# EAGLE design BusPirate-v5 (EAGLE 7.6.0)
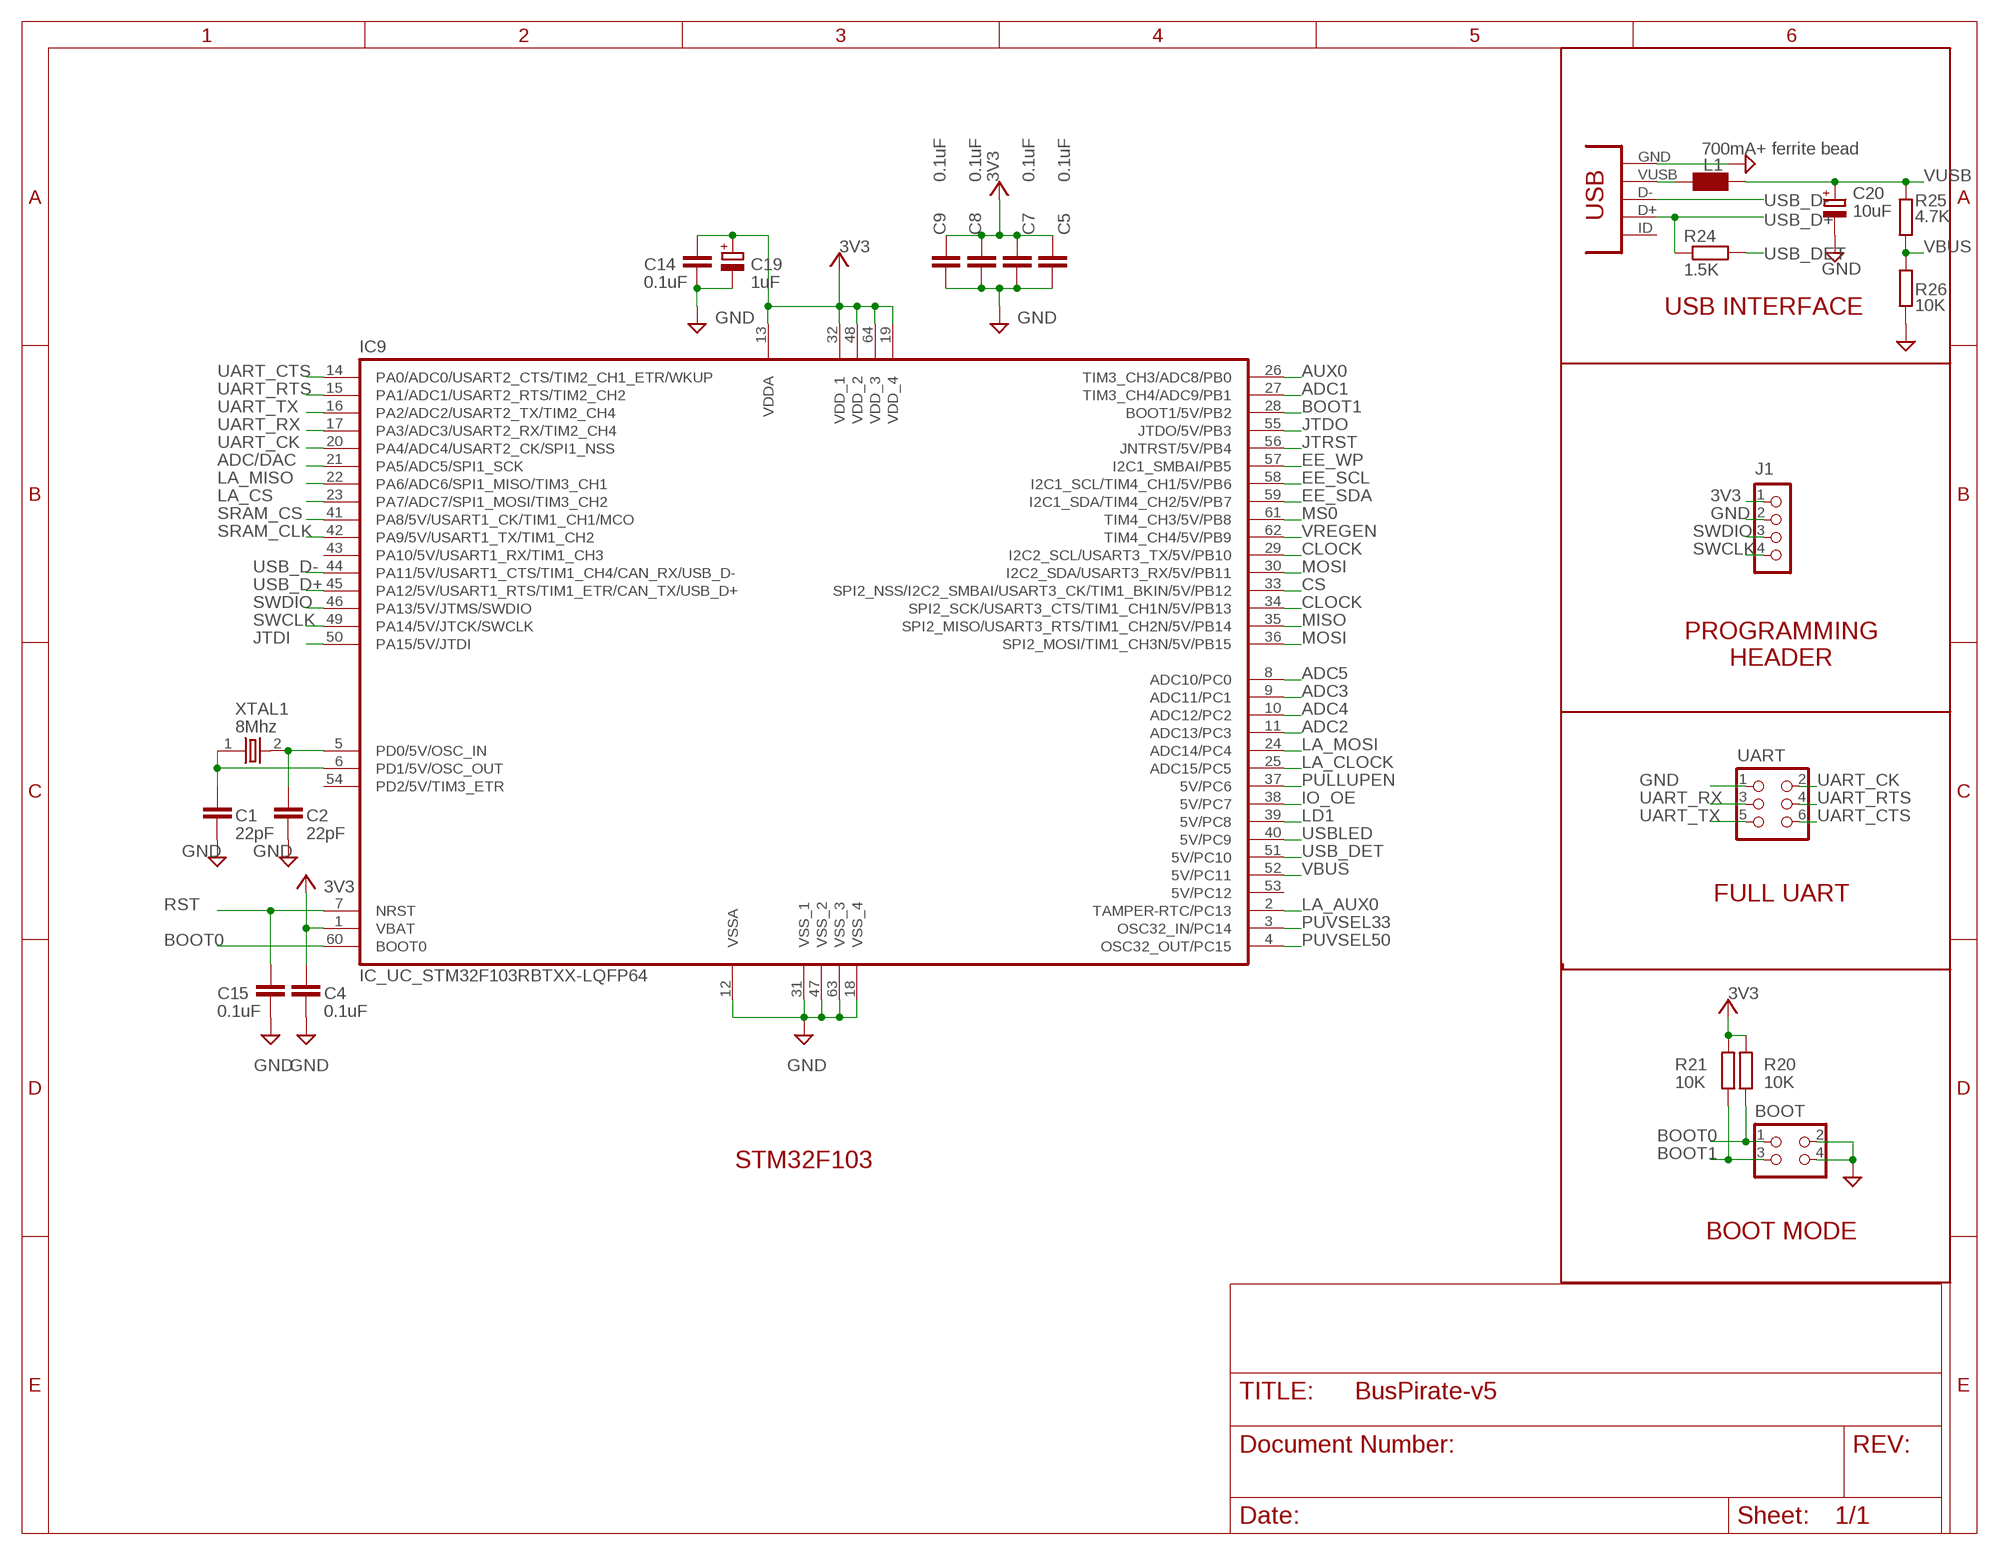
[diagram p0: schematic, sheet 1, part 1 of 2]
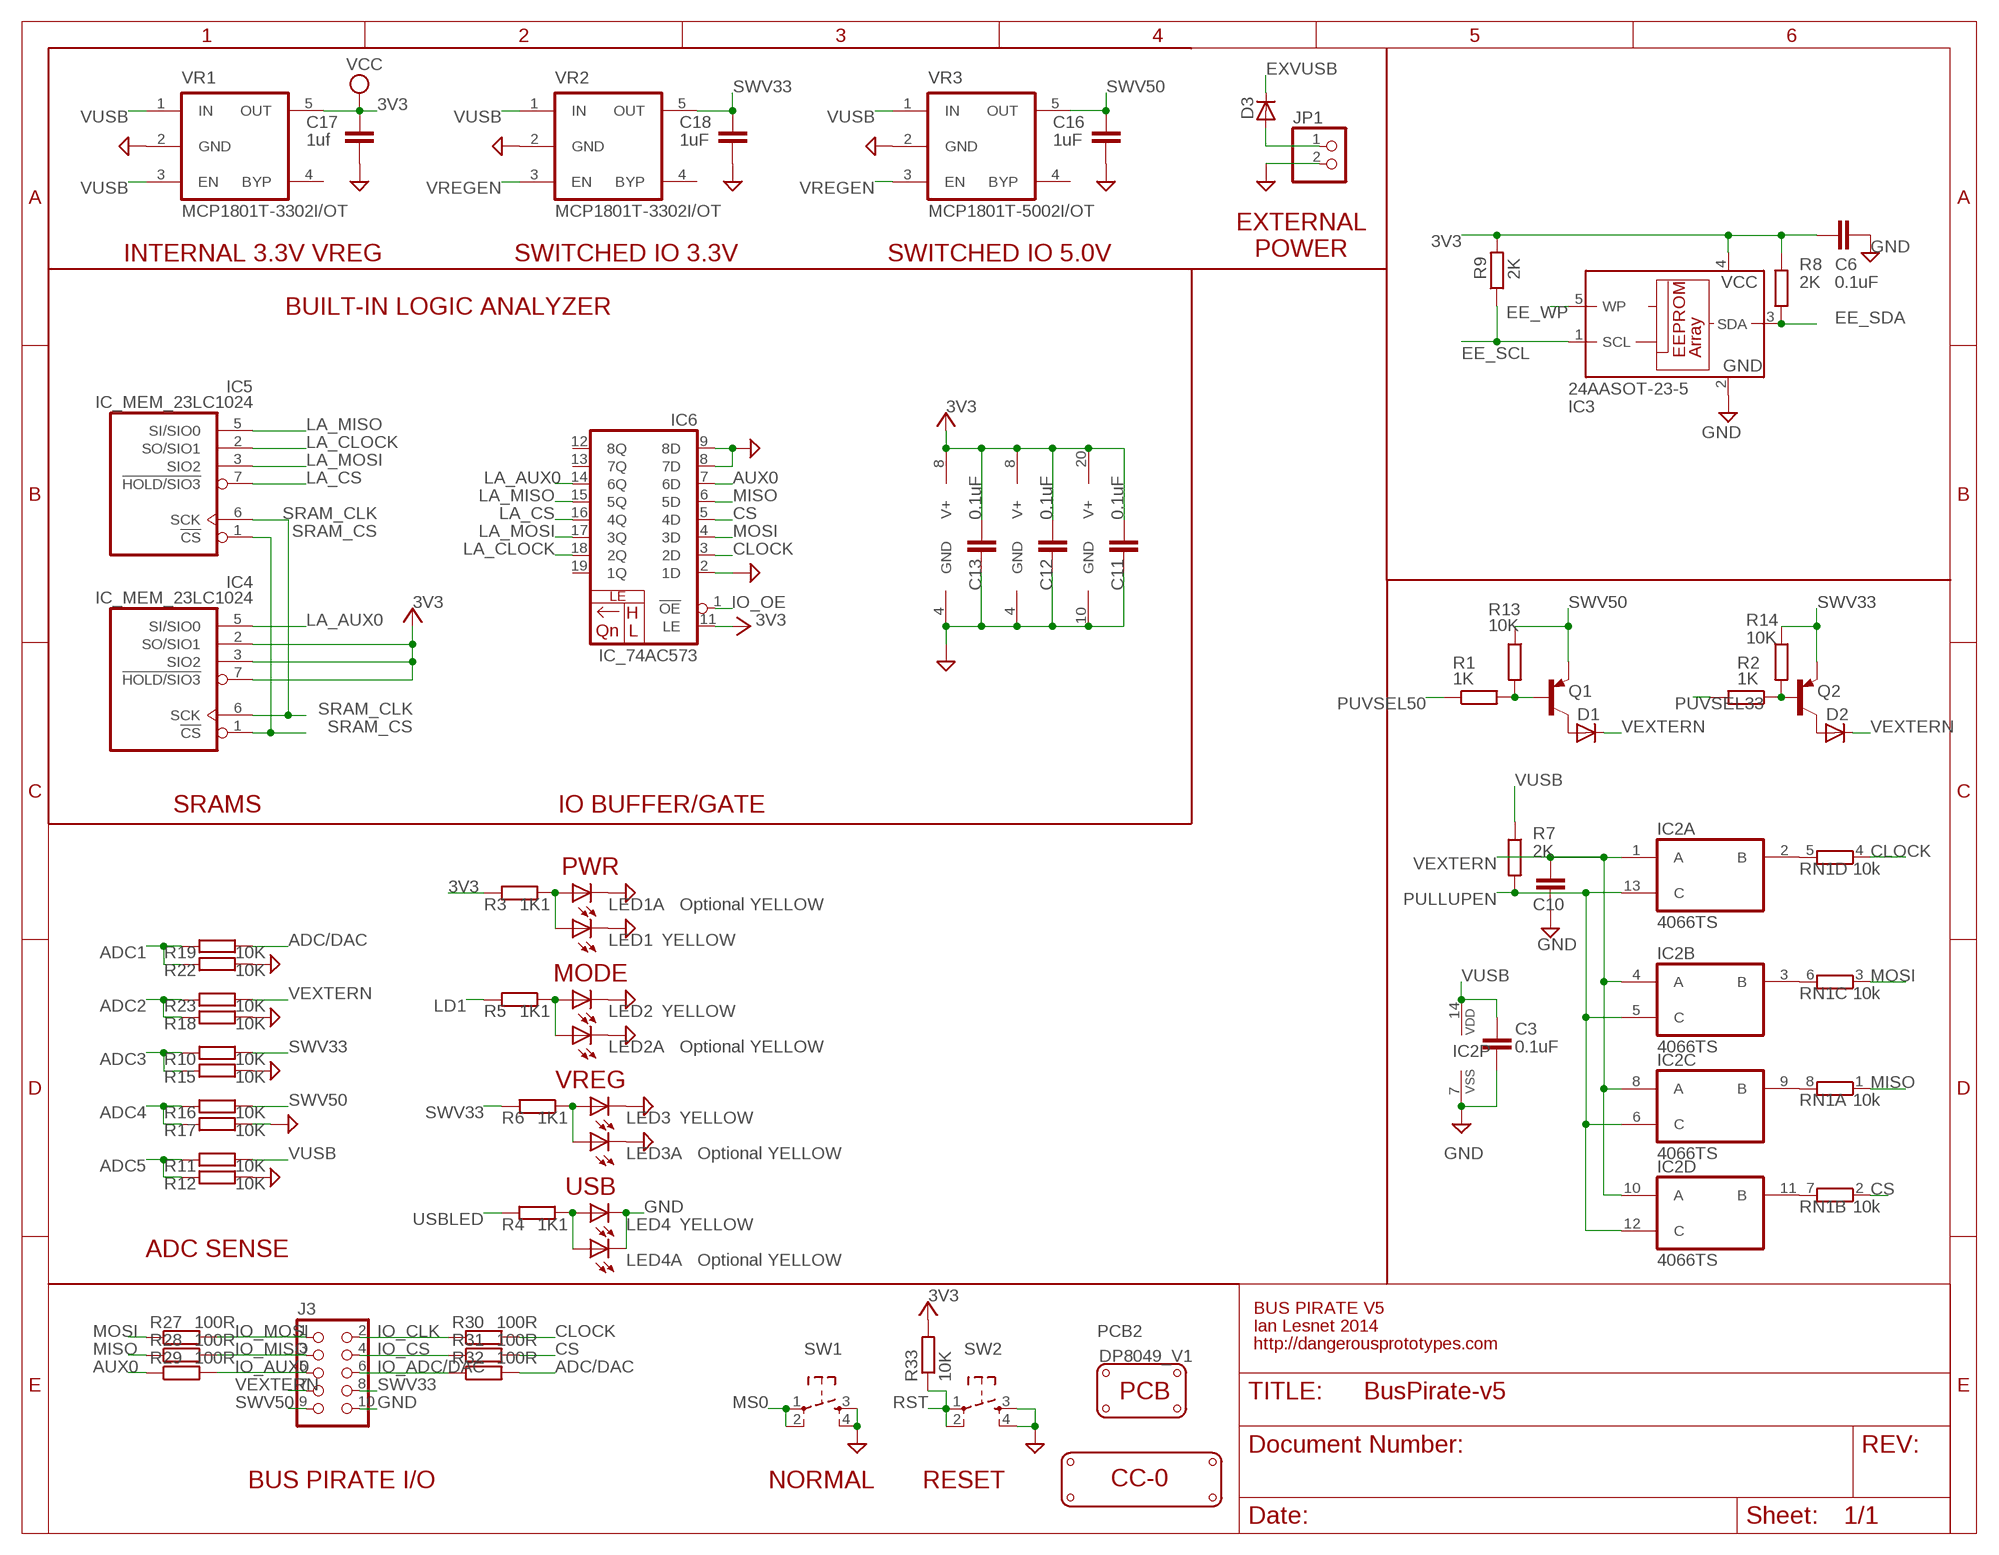
[diagram p1: schematic, sheet 1, part 2 of 2]

## Parts
BOOT  CON_HEADER_2X02-PTH  [M2X2]
C1  22pF  C-EUC0603  [C0603]
C2  22pF  C-EUC0603  [C0603]
C3  0.1uF  C-EUC0603  [C0603]
C4  0.1uF  C-EUC0603  [C0603]
C5  0.1uF  C-EUC0603  [C0603]
C6  0.1uF  C-EUC0603  [C0603]
C7  0.1uF  C-EUC0603  [C0603]
C8  0.1uF  C-EUC0603  [C0603]
C9  0.1uF  C-EUC0603  [C0603]
C10  0.1uF  C-EUC0603  [C0603]
C11  0.1uF  C-EUC0603  [C0603]
C12  0.1uF  C-EUC0603  [C0603]
C13  0.1uF  C-EUC0603  [C0603]
C14  0.1uF  C-EUC0603  [C0603]
C15  0.1uF  C-EUC0603  [C0603]
C16  1uF  C-EUC0603  [C0603]
C17  1uf  C-EUC0603  [C0603]
C18  1uF  C-EUC0603  [C0603]
C19  1uF  CPOL-EUSMCA  [SMC_A]
C20  10uF  CPOL-EUSMCA  [SMC_A]
D1  MBR0520LT  [SOD123]
D2  MBR0520LT  [SOD123]
D3  MBR0520LT  [SOD123]
IC2  4066TS  [40XX_TSSOP14]
IC3  24AASOT-23-5  24AA  [SOT-23-5@1]
IC4  IC_MEM_23LC1024  [SOIC-8]
IC5  IC_MEM_23LC1024  [SOIC-8]
IC6  IC_74AC573  IC_74AC573-TSSOP-20  [TSSOP-20]
IC9  IC_UC_STM32F103RBTXX-LQFP64  [LQFP64]
J1  CON_HEADER_1X04  [M1X4]
J3  CON_HEADER_2X05-PTH+SHROUDED_A  [PINSHRD_PTH_2X05]
JP1  PINHD-1X02_2.54-S  [1X02-S]
L1  700mA+ ferrite bead  WE-KIL_0805  [WE-KI_0805_B]
LED1  YELLOW  LED-0603  [LED-603]
LED1A  Optional YELLOW  LED-0603  [LED-603]
LED2  YELLOW  LED-0603  [LED-603]
LED2A  Optional YELLOW  LED-0603  [LED-603]
LED3  YELLOW  LED-0603  [LED-603]
LED3A  Optional YELLOW  LED-0603  [LED-603]
LED4  YELLOW  LED-0603  [LED-603]
LED4A  Optional YELLOW  LED-0603  [LED-603]
LOGO1  LOGO_CC-0  [LOGO_CC-0]
PCB2  PCB_DP_RECTANGLE-80X49  [DP8049_V1]
Q1  MMBTA56-SOT23  [SOT23]
Q2  MMBTA56-SOT23  [SOT23]
R1  1K  RESISTOR-0603  [R603]
R2  1K  R-EU_R0603  [R0603]
R3  1K1  RESISTOR-0603  [R603]
R4  1K1  RESISTOR-0603  [R603]
R5  1K1  RESISTOR-0603  [R603]
R6  1K1  RESISTOR-0603  [R603]
R7  2K  R-EU_R0603  [R0603]
R8  2K  R-EU_R0603  [R0603]
R9  2K  R-EU_R0603  [R0603]
R10  10K  R-EU_R0603  [R0603]
R11  10K  R-EU_R0603  [R0603]
R12  10K  R-EU_R0603  [R0603]
R13  10K  RESISTOR-0603  [R603]
R14  10K  R-EU_R0603  [R0603]
R15  10K  R-EU_R0603  [R0603]
R16  10K  R-EU_R0603  [R0603]
R17  10K  R-EU_R0603  [R0603]
R18  10K  R-EU_R0603  [R0603]
R19  10K  R-EU_R0603  [R0603]
R20  10K  R-EU_R0603  [R0603]
R21  10K  R-EU_R0603  [R0603]
R22  10K  R-EU_R0603  [R0603]
R23  10K  R-EU_R0603  [R0603]
R24  1.5K  RESISTOR-0603  [R603]
R25  4.7K  RESISTOR-0603  [R603]
R26  10K  RESISTOR-0603  [R603]
R27  100R  RESISTOR-0603  [R603]
R28  100R  RESISTOR-0603  [R603]
R29  100R  RESISTOR-0603  [R603]
R30  100R  RESISTOR-0603  [R603]
R31  100R  RESISTOR-0603  [R603]
R32  100R  RESISTOR-0603  [R603]
R33  10K  RESISTOR-0603  [R603]
RN1  10k  RNETWORK  [RN8P-4R-CRA06S]
SW1  SW_TACT_4P  [SW_TACT_SMALL]
SW2  SW_TACT_4P  [SW_TACT_SMALL]
UART  CON_HEADER_2X03-PTH  [M2X3]
USB  USB mini-b  CON-USB-MINI-BUSB1  [CONN_USB_MINI-B]
VR1  MCP1801T-3302I/OT  MIC5205  [SOT-23-5@1]
VR2  MCP1801T-3302I/OT  MIC5205  [SOT-23-5@1]
VR3  MCP1801T-5002I/OT  MIC5205  [SOT-23-5@1]
XTAL1  8Mhz  OSC-XTAL-12M  [XTAL_4X6]

## Nets
3V3: C4.2 C5.2 C6.1 C7.2 C8.2 C9.2 C11.1 C12.1 C13.1 C14.2 C17.1 C19.+ IC3.4(VCC) IC4.2(SO/SIO1) IC4.3(SIO2) IC4.7(!HOLD/SIO3) IC4.8(V+) IC5.8(V+) IC6.11(LE) IC6.20(V+) IC9.1(VBAT) IC9.13(VDDA) IC9.19(VDD_4) IC9.32(VDD_1) IC9.48(VDD_2) IC9.64(VDD_3) J1.1 R3.2 R8.2 R9.2 R20.2 R21.2 R33.2 VR1.5(OUT) ; supply symbol labelled VCC, V+
ADC1: IC9.27(TIM3_CH4/ADC9/PB1) R19.2 R22.2
ADC2: IC9.11(ADC13/PC3) R18.2 R23.2
ADC3: IC9.9(ADC11/PC1) R10.2 R15.2
ADC4: IC9.10(ADC12/PC2) R16.2 R17.2
ADC5: IC9.8(ADC10/PC0) R11.2 R12.2
ADC/DAC: IC9.21(PA5/ADC5/SPI1_SCK) R19.1 R32.2
AUX0: IC6.7(6D) IC9.26(TIM3_CH3/ADC8/PB0) R29.1
BOOT0: BOOT.1 IC9.60(BOOT0) R20.1
BOOT1: BOOT.3 IC9.28(BOOT1/5V/PB2) R21.1
CLOCK: IC6.3(2D) IC9.29(I2C2_SCL/USART3_TX/5V/PB10) IC9.34(SPI2_SCK/USART3_CTS/TIM1_CH1N/5V/PB13) R30.2 RN1.4
CS: IC6.5(4D) IC9.33(SPI2_NSS/I2C2_SMBAI/USART3_CK/TIM1_BKIN/5V/PB12) R31.2 RN1.2
EE_SCL: IC3.1(SCL) IC9.58(I2C1_SCL/TIM4_CH1/5V/PB6) R9.1
EE_SDA: IC3.3(SDA) IC9.59(I2C1_SDA/TIM4_CH2/5V/PB7) R8.1
EE_WP: IC3.5(WP) IC9.57(I2C1_SMBAI/PB5)
EXVUSB: D3.C L1.2 USB.VUSB
GND: BOOT.2 BOOT.4 C1.1 C2.1 C3.2 C4.1 C5.1 C6.2 C7.1 C8.1 C9.1 C10.2 C11.2 C12.2 C13.2 C14.1 C15.1 C16.2 C17.2 C18.2 C19.- C20.- IC2.7(P:VSS) IC3.2(GND) IC4.4(GND) IC5.4(GND) IC6.2(1D) IC6.8(7D) IC6.9(8D) IC6.10(GND) IC9.12(VSSA) IC9.18(VSS_4) IC9.31(VSS_1) IC9.47(VSS_2) IC9.63(VSS_3) J1.2 J3.10 JP1.2 LED1.C LED1A.C LED2.C LED2A.C LED3.C LED3A.C LED4.C LED4A.C R12.1 R15.1 R17.1 R18.1 R22.1 R26.1 SW1.3 SW1.4 SW2.3 SW2.4 UART.1 USB.GND VR1.2(GND) VR2.2(GND) VR3.2(GND)
IO_ADC/DAC: J3.6 R32.1
IO_AUX0: J3.5 R29.2
IO_CLK: J3.2 R30.1
IO_CS: J3.4 R31.1
IO_MISO: J3.3 R28.2
IO_MOSI: J3.1 R27.2
IO_OE: IC6.1(!OE) IC9.38(5V/PC7)
JTDI: IC9.50(PA15/5V/JTDI)
JTDO: IC9.55(JTDO/5V/PB3)
JTRST: IC9.56(JNTRST/5V/PB4)
LA_AUX0: IC4.5(SI/SIO0) IC6.14(6Q) IC9.2(TAMPER-RTC/PC13)
LA_CLOCK: IC5.2(SO/SIO1) IC6.18(2Q) IC9.25(ADC15/PC5)
LA_CS: IC5.7(!HOLD/SIO3) IC6.16(4Q) IC9.23(PA7/ADC7/SPI1_MOSI/TIM3_CH2)
LA_MISO: IC5.5(SI/SIO0) IC6.15(5Q) IC9.22(PA6/ADC6/SPI1_MISO/TIM3_CH1)
LA_MOSI: IC5.3(SIO2) IC6.17(3Q) IC9.24(ADC14/PC4)
LD1: IC9.39(5V/PC8) R5.2
MISO: IC6.6(5D) IC9.35(SPI2_MISO/USART3_RTS/TIM1_CH2N/5V/PB14) R28.1 RN1.1
MOSI: IC6.4(3D) IC9.30(I2C2_SDA/USART3_RX/5V/PB11) IC9.36(SPI2_MOSI/TIM1_CH3N/5V/PB15) R27.1 RN1.3
MS0: IC9.61(TIM4_CH3/5V/PB8) SW1.1 SW1.2
N$1: IC2.2(A:B) RN1.5
N$2: IC2.11(D:B) RN1.7
N$3: D1.A Q1.3(C)
N$4: IC2.9(C:B) RN1.8
N$5: IC2.3(B:B) RN1.6
N$6: LED2.A LED2A.A R5.1
N$7: LED1.A LED1A.A R3.1
N$8: Q2.1(B) R2.1 R14.2
N$13: LED4.A LED4A.A R4.1
N$14: D2.A Q2.3(C)
N$15: D3.A JP1.1
N$16: C2.2 IC9.5(PD0/5V/OSC_IN) XTAL1.2
N$17: Q1.1(B) R1.2 R13.2
N$18: LED3.A LED3A.A R6.1
N$20: C1.2 IC9.6(PD1/5V/OSC_OUT) XTAL1.1
PULLUPEN: IC2.5(B:C) IC2.6(C:C) IC2.12(D:C) IC2.13(A:C) IC9.37(5V/PC6) R7.2
PUVSEL33: IC9.3(OSC32_IN/PC14) R2.2
PUVSEL50: IC9.4(OSC32_OUT/PC15) R1.1
RST: C15.2 IC9.7(NRST) R33.1 SW2.1 SW2.2
SRAM_CLK: IC4.6(SCK) IC5.6(SCK) IC9.42(PA9/5V/USART1_TX/TIM1_CH2)
SRAM_CS: IC4.1(!CS) IC5.1(!CS) IC9.41(PA8/5V/USART1_CK/TIM1_CH1/MCO)
SWCLK: IC9.49(PA14/5V/JTCK/SWCLK) J1.4
SWDIO: IC9.46(PA13/5V/JTMS/SWDIO) J1.3
SWV33: C18.1 J3.8 Q2.2(E) R6.2 R10.1 R14.1 VR2.5(OUT)
SWV50: C16.1 J3.9 Q1.2(E) R13.1 R16.1 VR3.5(OUT)
UART_CK: IC9.20(PA4/ADC4/USART2_CK/SPI1_NSS) UART.2
UART_CTS: IC9.14(PA0/ADC0/USART2_CTS/TIM2_CH1_ETR/WKUP) UART.6
UART_RTS: IC9.15(PA1/ADC1/USART2_RTS/TIM2_CH2) UART.4
UART_RX: IC9.17(PA3/ADC3/USART2_RX/TIM2_CH4) UART.3
UART_TX: IC9.16(PA2/ADC2/USART2_TX/TIM2_CH4) UART.5
USB_D+: IC9.45(PA12/5V/USART1_RTS/TIM1_ETR/CAN_TX/USB_D+) R24.1 USB.D+
USB_D-: IC9.44(PA11/5V/USART1_CTS/TIM1_CH4/CAN_RX/USB_D-) USB.D-
USB_DET: IC9.51(5V/PC10) R24.2
USBLED: IC9.40(5V/PC9) R4.2
VBUS: IC9.52(5V/PC11) R25.1 R26.2
VEXTERN: C10.1 D1.C D2.C IC2.1(A:A) IC2.4(B:A) IC2.8(C:A) IC2.10(D:A) J3.7 R23.1
VREGEN: IC9.62(TIM4_CH4/5V/PB9) VR2.3(EN) VR3.3(EN)
VUSB: C3.1 C20.+ IC2.14(P:VDD) L1.1 R7.1 R11.1 R25.2 VR1.1(IN) VR1.3(EN) VR2.1(IN) VR3.1(IN)
Unconnected: IC6.12(8Q) IC6.13(7Q) IC6.19(1Q) IC9.43(PA10/5V/USART1_RX/TIM1_CH3) IC9.53(5V/PC12) IC9.54(PD2/5V/TIM3_ETR) USB.BODY@1(BODY) USB.BODY@2(BODY) USB.BODY@3(BODY) USB.BODY@4(BODY) USB.ID(USBID) VR1.4(BYP) VR2.4(BYP) VR3.4(BYP)

## Notes on the sheet
- EXTERNAL
  POWER
- INTERNAL 3.3V VREG | SWITCHED IO 3.3V | SWITCHED IO 5.0V
- USB INTERFACE | BUILT-IN LOGIC ANALYZER
- PROGRAMMING
  HEADER
- SRAMS | IO BUFFER/GATE
- PWR
- FULL UART
- MODE
- VREG
- STM32F103
- USB
- BOOT MODE
- ADC SENSE
- BUS PIRATE V5
- Ian Lesnet 2014
- http://dangerousprototypes.com
- BUS PIRATE I/O | NORMAL | RESET

## Library data of the parts
BOOT = dp_devices:CON_HEADER_2X02
C1-C18 = rcl:C-EU: CAPACITOR, European symbol
C19 C20 = rcl:CPOL-EU: POLARIZED CAPACITOR, European symbol
D1-D3 = diode:MBR0520LT: SCHOTTKY BARRIER RECTIFIER Source: http://onsemi.com .. MBR0520LT1-D.pdf
IC2 = 40xx:4066: Quad bilateral ANALOG SWITCH
IC3 = dp_devices:24AA*; 24AA: 24AA
IC4 IC5 = dp_devices:IC_MEM_23LC1024: 1Mbit SPI SRAM with Serial dual interface and Serial quad interface
IC6 = dp_devices:IC_74AC573: 8 Transparent Latch with 3-state output Mfr no: SN74AC573NSR Digikey <http://www.digikey.com/product-detail/en/SN74AC573NSR/296-29119-1-ND/2690568>
IC9 = dp_devices:IC_UC_STM32F103RBTXX: 32-bit ARM-based MCU with 64 or 128KB Flash
J1 = dp_devices.v6:CON_HEADER_1X04
J3 = dp_devices:CON_HEADER_2X05: 2x05 pin header
JP1 = pinhead-2:PINHD-1X02: PIN HEADER
L1 = wuerth-elektronik:WE-KIL: SMD Wire Wound Ceramic Inductor WE-KIL - Low profile - High Q values -- Bluetooth -- Wireless LAN -- RF oscillation circuit -- IF impedance matching
LED1 LED1A LED2 LED2A LED3 LED3A LED4 LED4A = dp_devices:LED: Light Emitting Diode
LOGO1 = dp_devices:LOGO_CC-0
PCB2 = dp_devices:PCB_DP_RECTANGLE: Dangerous Prototypes Standard Rectangular PCB sizes; PCB_SIZE: DP8049_V1
Q1 Q2 = transistor-pnp:*-?: PNP Transistor
R1 R24-R33 = dp_devices.v6:RESISTOR
R2 R7-R9 R14 R20 R21 = rcl:R-EU_: RESISTOR, European symbol
R3-R6 R13 = dp_devices:RESISTOR
R10-R12 R15-R19 R22 R23 = resistor:R-EU_: RESISTOR, European symbol
RN1 = dp_devices:RNETWORK: 4 Resistor Array 0603
SW1 SW2 = dp_devices.v6:SW_TACT_4P
UART = dp_devices:CON_HEADER_2X03
USB = dp_devices:CON-USB-MINI-B: USB connector
VR1-VR3 = dp_devices:MIC5205: 150ma Low-Noise LDO Regulator
XTAL1 = dp_devices:OSC-XTAL

## Board
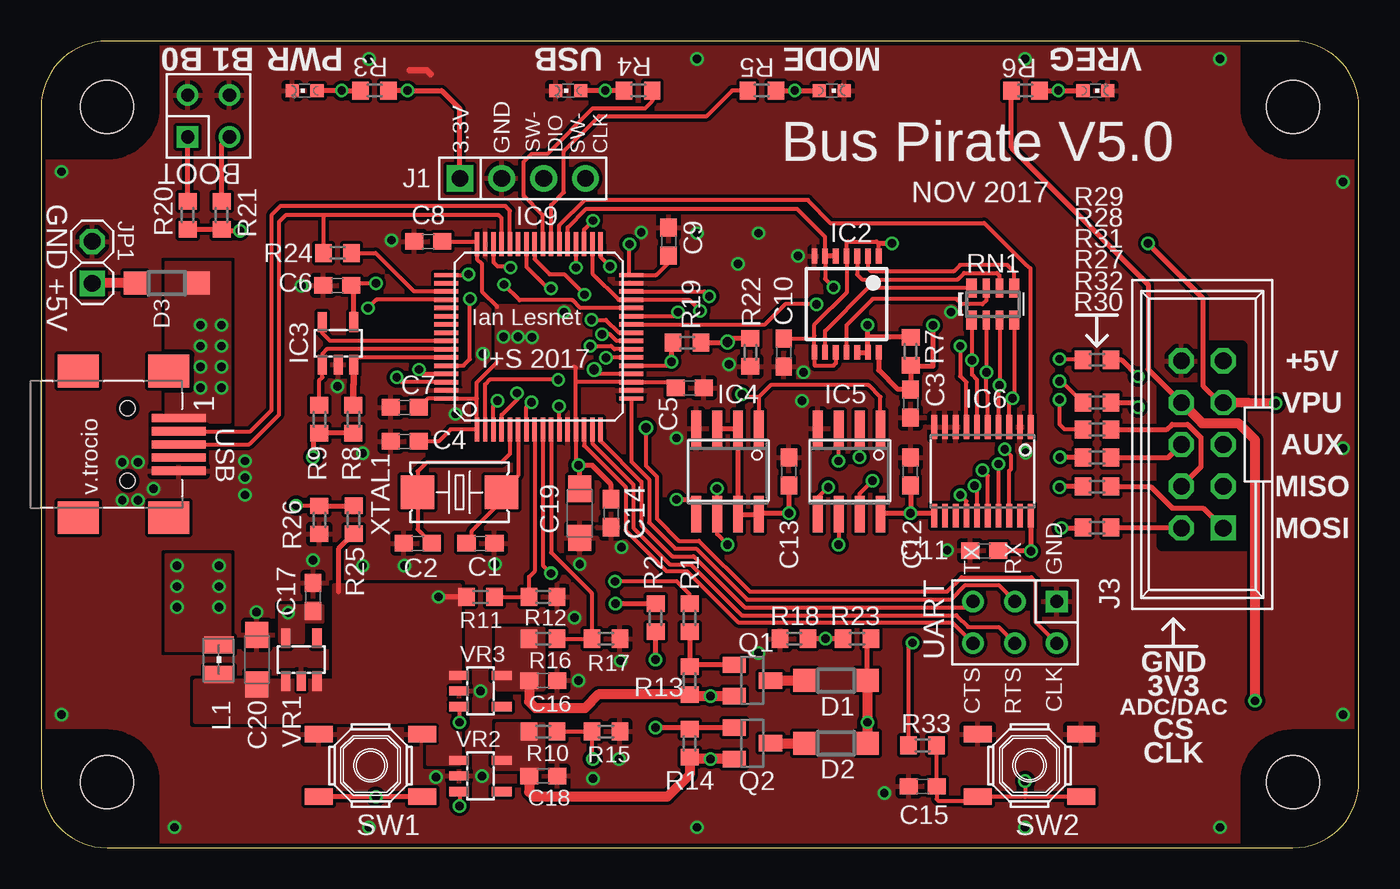
[diagram p2: board, top side]
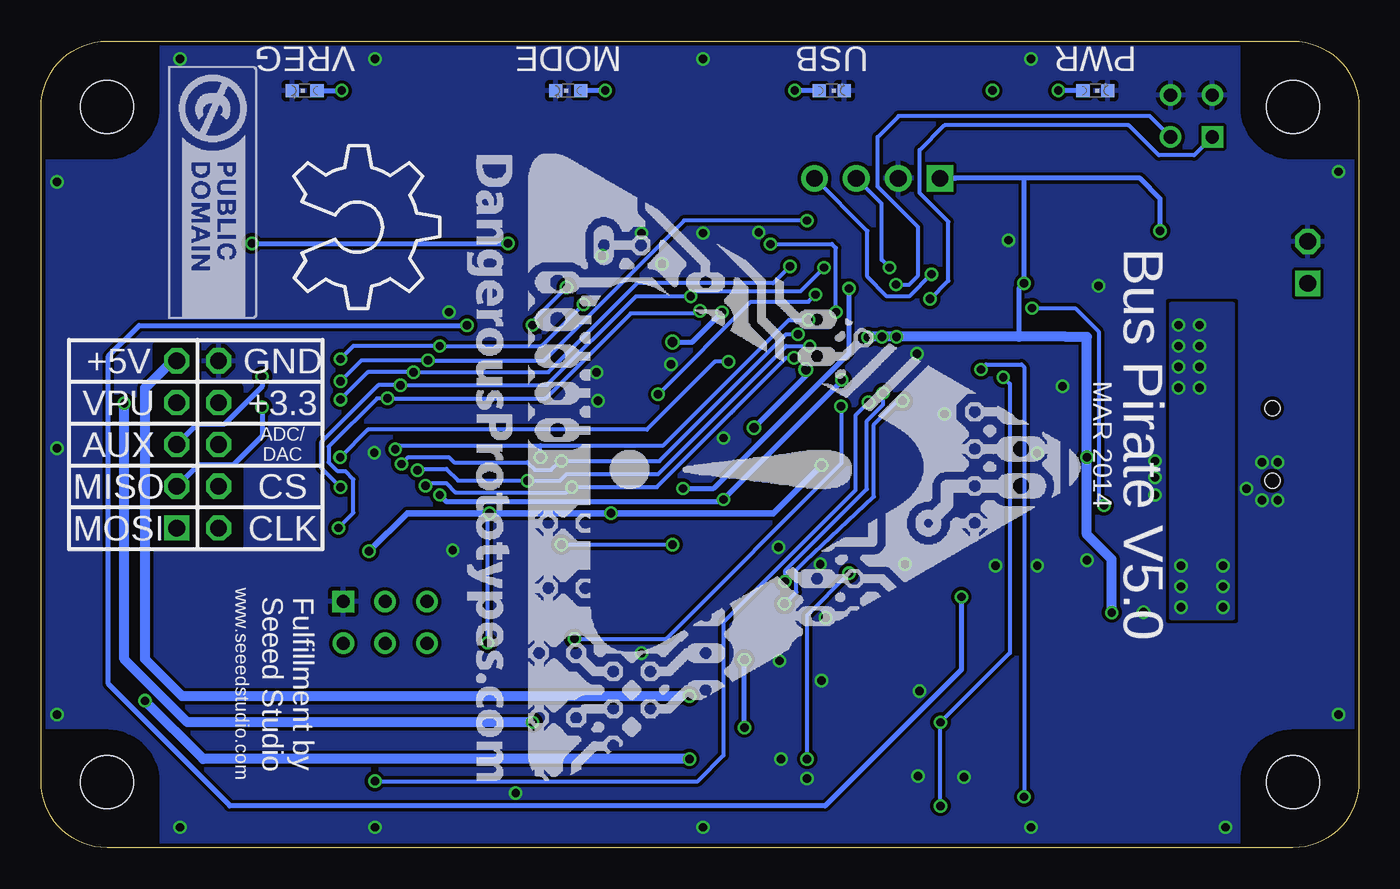
[diagram p3: board, bottom side, seen from below]

Size 80 x 49 mm. Coordinates in mm from the lower left corner, seen from the top.
Copper layers (1*16): Top 0.035mm / dielectric 1.5mm / Bottom 0.035mm
Design rules "dirt_cheap_dirty_boards.v1.1": minimum track width 6mil, minimum drill 12mil, track to track 6mil, track to pad 6mil, pad to pad 6mil, via to via 6mil, smd to smd 0mil, copper to edge 10mil, drill to drill 10mil, minimum pad ring 10mil, minimum via ring 6mil, stop-mask expansion 2mil, vias tented up to drill 25mil, thermal gap 10mil
tRestrict: area 68.1,18.4 to 72.9,30.5
bRestrict: area 68.1,18.4 to 72.9,30.5

### Footprints (pad centres in the part's own frame; a part is rotated, then mirrored left to right if it is on the bottom)
M2X2 = drill 0.8 square: 1 -1.27,-1.27 | drill 0.8: 2 -1.27,1.27; 3 1.27,-1.27; 4 1.27,1.27
C0603 = smd 1.1 x 1: 1 -0.85,0; 2 0.85,0
SMC_A = smd 1.6 x 1.4: + -1.5,0; - 1.5,0
SOD123 = smd 1.4 x 1.4: A 1.9,0; C -1.9,0
40XX_TSSOP14 = smd 0.35 x 0.9: 1 -1.95,-2.925; 2 -1.3,-2.925; 3 -0.65,-2.925; 4 0,-2.925; 5 0.65,-2.925; 6 1.3,-2.925; 7 1.95,-2.925; 8 1.95,2.925; 9 1.3,2.925; 10 0.65,2.925; 11 0,2.925; 12 -0.65,2.925; 13 -1.3,2.925; 14 -1.95,2.925
SOT-23-5@1 = smd 0.55 x 1.2: 1 -0.95,-1.3; 2 0,-1.3; 3 0.95,-1.3; 4 0.95,1.3; 5 -0.95,1.3
SOIC-8 = smd 0.6 x 2.2: 1 -1.905,-2.6; 2 -0.635,-2.6; 3 0.635,-2.6; 4 1.905,-2.6; 5 1.905,2.6; 6 0.635,2.6; 7 -0.635,2.6; 8 -1.905,2.6
TSSOP-20 = smd 0.35 x 1.43: 1 -2.925,-2.7; 2 -2.275,-2.7; 3 -1.625,-2.7; 4 -0.975,-2.7; 5 -0.325,-2.7; 6 0.325,-2.7; 7 0.975,-2.7; 8 1.625,-2.7; 9 2.275,-2.7; 10 2.925,-2.7; 11 2.925,2.7; 12 2.275,2.7; 13 1.625,2.7; 14 0.975,2.7; 15 0.325,2.7; 16 -0.325,2.7; 17 -0.975,2.7; 18 -1.625,2.7; 19 -2.275,2.7; 20 -2.925,2.7
LQFP64 = smd 1.45 x 0.27: 1 -5.625,3.75; 2 -5.625,3.25; 3 -5.625,2.75; 4 -5.625,2.25; 5 -5.625,1.75; 6 -5.625,1.25; 7 -5.625,0.75; 8 -5.625,0.25; 9 -5.625,-0.25; 10 -5.625,-0.75; 11 -5.625,-1.25; 12 -5.625,-1.75; 13 -5.625,-2.25; 14 -5.625,-2.75; 15 -5.625,-3.25; 16 -5.625,-3.75; 33 5.625,-3.75; 34 5.625,-3.25; 35 5.625,-2.75; 36 5.625,-2.25; 37 5.625,-1.75; 38 5.625,-1.25; 39 5.625,-0.75; 40 5.625,-0.25; 41 5.625,0.25; 42 5.625,0.75; 43 5.625,1.25; 44 5.625,1.75; 45 5.625,2.25; 46 5.625,2.75; 47 5.625,3.25; 48 5.625,3.75 | smd 0.27 x 1.45: 17 -3.75,-5.625; 18 -3.25,-5.625; 19 -2.75,-5.625; 20 -2.25,-5.625; 21 -1.75,-5.625; 22 -1.25,-5.625; 23 -0.75,-5.625; 24 -0.25,-5.625; 25 0.25,-5.625; 26 0.75,-5.625; 27 1.25,-5.625; 28 1.75,-5.625; 29 2.25,-5.625; 30 2.75,-5.625; 31 3.25,-5.625; 32 3.75,-5.625; 49 3.75,5.625; 50 3.25,5.625; 51 2.75,5.625; 52 2.25,5.625; 53 1.75,5.625; 54 1.25,5.625; 55 0.75,5.625; 56 0.25,5.625; 57 -0.25,5.625; 58 -0.75,5.625; 59 -1.25,5.625; 60 -1.75,5.625; 61 -2.25,5.625; 62 -2.75,5.625; 63 -3.25,5.625; 64 -3.75,5.625
M1X4 = drill 1.02 pad 1.632 square: 1 0,0 | drill 1.02 pad 1.632: 2 2.54,0; 3 5.08,0; 4 7.62,0
PINSHRD_PTH_2X05 = drill 1.016 square: 1 -5.08,-1.27 | drill 1.016 octagon: 2 -5.08,1.27; 3 -2.54,-1.27; 4 -2.54,1.27; 5 0,-1.27; 6 0,1.27; 7 2.54,-1.27; 8 2.54,1.27; 9 5.08,-1.27; 10 5.08,1.27
1X02-S = drill 1.016 square: 1 -1.27,0 | drill 1.016 octagon: 2 1.27,0
WE-KI_0805_B = smd 1.02 x 1.78: 1 -0.89,0; 2 0.89,0
LED-603 = smd 0.8 x 0.8: A 0,-0.75; C 0,0.75
DP8049_V1 = hole 3.2: -36,-20.5; 36,-20.5; 36,20.5; -36,20.5
SOT23 = smd 1 x 1.4: 1 -0.95,-1.1; 2 0.95,-1.1; 3 0,1.1
R603 = smd 1 x 1.1: 1 -0.85,0; 2 0.85,0
R0603 = smd 1 x 1.1: 1 -0.85,0; 2 0.85,0
RN8P-4R-CRA06S = smd 0.63 x 1.15: 1 -1.295,-0.975; 4 1.295,-0.975; 5 1.295,0.975; 8 -1.295,0.975 | smd 0.44 x 1.15: 2 -0.4,-0.975; 3 0.4,-0.975; 6 0.4,0.975; 7 -0.4,0.975
SW_TACT_SMALL = smd 1.7 x 1: 1 -3.15,1.9; 2 3.15,1.9; 3 -3.15,-1.9; 4 3.15,-1.9
M2X3 = drill 0.8 square: 1 -2.54,-1.27 | drill 0.8: 2 -2.54,1.27; 3 0,-1.27; 4 0,1.27; 5 2.54,-1.27; 6 2.54,1.27
CONN_USB_MINI-B = smd 2 x 2.5: BODY@1 -4.45,2.5; BODY@2 4.45,2.5; BODY@3 4.45,-3; BODY@4 -4.45,-3 | smd 0.5 x 3.3: D+ 0,3.1; D- -0.8,3.1; GND 1.6,3.1; ID 0.8,3.1; VUSB -1.6,3.1 | hole 0.9: -2.2,0; 2.2,0
XTAL_4X6 = smd 2.032 x 2.032: 1 -2.54,0; 2 2.54,0

### Placement (x,y rotation side)
BOOT  10.16,44.45 0 top
C1  26.67,18.49 180 top
C2  22.86,18.49 0 top
C3  52.78,26.99 270 top
C4  22.07,24.69 0 top
C5  39.37,27.94 180 top
C6  17.99,34.16 180 top
C7  22.07,26.75 0 top
C8  23.5,36.83 0 top
C9  38.1,36.83 270 top
C10  45.09,30.08 270 top
C11  57.25,18.05 180 top
C12  52.78,22.86 90 top
C13  45.4,22.86 90 top
C14  34.61,20.32 90 top
C15  53.52,3.73 0 top
C16  30.48,10.16 0 top
C17  16.51,15.24 90 top
C18  30.48,4.37 0 top
C19  32.7,20.32 270 top
C20  13.1,11.43 90 top
D1  48.26,10.16 180 top
D2  48.26,6.35 180 top
D3  7.62,34.29 180 top
IC2  48.9,33.02 180 top
IC3  18.03,30.64 0 top
IC4  41.67,22.86 180 top
IC5  49.05,22.86 180 top
IC6  57.15,22.86 180 top
IC9  30.21,31.04 90 top
J1  25.43,40.67 0 top
J3  70.5,24.5 90 top
JP1  3.1,35.56 90 top
L1  10.79,11.43 90 top
LED1  16,46 90 top
LED1A  16,46 270 bottom
LED2  48,46 270 top
LED2A  48,46 90 bottom
LED3  64,46 270 top
LED3A  64,46 90 bottom
LED4  32,46 90 top
LED4A  32,46 270 bottom
LOGO1  72.27,47.47 270 bottom
PCB2  40,24.5 0 top
Q1  43.18,10.16 270 top
Q2  43.18,6.35 270 top
R1  39.37,13.97 270 top
R2  37.31,13.97 90 top
R3  20.25,46 0 top
R4  36.25,46 0 top
R5  43.75,46 180 top
R6  59.75,46 180 top
R7  52.78,30.16 90 top
R8  18.95,26.04 270 top
R9  16.89,26.04 270 top
R10  30.48,7.06 0 top
R11  26.67,15.24 0 top
R12  30.48,15.24 180 top
R13  39.37,10.16 90 top
R14  39.37,6.35 90 top
R15  34.29,7.06 180 top
R16  30.48,12.7 0 top
R17  34.29,12.7 180 top
R18  45.72,12.7 0 top
R19  39.22,30.68 0 top
R20  8.89,38.43 270 top
R21  10.95,38.43 270 top
R22  43.06,30.09 90 top
R23  49.53,12.7 180 top
R24  18,36.13 0 top
R25  18.97,19.92 270 top
R26  16.89,19.91 90 top
R27  64.1,21.94 0 top
R28  64.1,27.05 0 top
R29  64.1,29.64 0 top
R30  64.1,19.45 180 top
R31  64.1,25.41 180 top
R32  64.1,23.71 180 top
R33  53.52,6.22 180 top
RN1  57.78,33.02 0 top
SW1  20,5 180 top
SW2  60,5 180 top
U$1  [DP-LOGO]  61.84,-11.22 0 top  (outside the outline)
U$2  [OSHW_8X350_NOTEXT]  64.67,42.67 270 bottom
U$4  [DP_LOGO_ART_1.5X1.5]  54.12,42.15 270 bottom
UART  59.12,13.69 180 top
USB  5.25,24.5 270 top
VR1  15.8,11.43 0 top
VR2  26.67,4.37 270 top
VR3  26.67,9.53 270 top
XTAL1  25.4,21.59 180 top

### Tracks (layer width: path | path; a pad name or v marks a point on that pad's centre or on a via)
3V3  (via drill 0.51)
  Top 0.254: 19.11,34.37 19.11,34.35 19.05,34.29 v20.32,34.29 | C8.2 26.46,36.83 IC9.48 26.46,35.77 26.75,35.48 26.75,33.8 27.69,32.86 | C4.2 24.13,24.69 24.86,25.41 IC9.1 26.46,27.26 26.43,27.29 | C7.2 23.46,27.29 IC9.64 26.43,27.29 | C9.2 38.1,35.56 37.33,34.79 IC9.32 35.77,34.79 35.72,34.85 v35.72,36.67 | C5.2 38.17,28.29 IC9.19 32.46,28.29 | 32.46,28.29 IC9.13 32.46,23.4 | 26.43,27.29 26.43,28.26 27.69,29.52 | 32.46,28.29 32.46,29.14 32.36,29.25 | R33.2 52.67,12.22 v52.9,12.45
  Top 0.305: IC3.4 18.98,34.09 C6.1 18.98,34.23 19.11,34.37 | 16.87,25.16 R9.2 R8.2 16.53,25.19 16.51,25.16 v16.51,23.73 | R3.2 v22.25,46 24.32,46 25.43,44.9 J1.1 | C12.1 v52.78,20.32 | v52.78,20.32 51.02,20.32 IC5.8 | C13.1 v45.4,20.32 43.64,20.32 IC4.8 IC4.7 IC4.2 IC4.3 | IC6.20 60.08,20.31 60.09,20.32 v60.09,18.02 60.06,18.05 C11.1 | R20.2 R21.2 10.95,37.48 v12.06,37.48 | 32.46,23.4 v32.62,23.24 | C14.2 34.61,22.07 33.43,23.24 v32.62,23.24 | C19.+ 32.7,23.16 v32.62,23.24 | IC6.11 54.23,20.32 v52.78,20.32
  Bottom 0.254: 20.32,31.11 20.32,31.04 | v35.72,36.67 31.99,36.67 31.75,36.43 v31.75,32.54 | 29.84,31.07 v29.79,31.02 | v52.9,12.45 52.9,20.21 v52.78,20.32
  Bottom 0.305: 17.78,31.04 20.25,31.04 20.32,31.11 | v12.06,37.48 12.06,39.45 13.28,40.66 20.32,40.66 | 24.47,40.66 J1.1 20.32,40.66 | 20.32,40.66 v20.32,34.29 20.64,33.97 20.64,31.04
  Bottom 0.406: v32.62,23.24 35.54,20.32 v45.4,20.32 v52.78,20.32 57.78,20.32 v60.09,18.02
  Bottom 0.61: v15,14.29 15,17.52 16.51,19.02 v16.51,23.73 16.51,31.04 17.78,31.04 20.64,31.04 29.77,31.04 v29.79,31.02
  other vias: 28.07,31.04 28.94,31.04
  pour Top (isolate 0.152, no thermals): 27.66,32.95 32.27,32.95 32.86,32.94 33.02,32.95 33.38,32.95 33.38,29.14 27.66,29.14
  pour Top (no thermals): 14.53,14.68 17.07,14.68 17.07,13.73 15.88,13.73 15.88,12.46 14.53,12.46
ADC1  (via drill 0.51, 0.58)
  Top 0.254: IC9.27 38.4,32.29 v38.66,32.54
  Top 0.305: R22.2 41.9,30.94 v41.67,30.72 41.63,30.68 R19.2
  Bottom 0.305: v41.67,30.72 40.48,30.72 v38.66,32.54
ADC2  (via drill 0.51)
  Top 0.254: IC9.11 31.46,26.8 v31.43,26.83
  Top 0.305: R23.2 v47.62,12.7 R18.2
  Bottom 0.254: v31.43,26.83 31.43,23.33 42.06,12.7 v47.62,12.7
ADC3  (via drill 0.51)
  Top 0.254: R10.2 R15.2 33.44,5.45 v33.5,5.4 | IC9.9 30.46,17.16 v30.96,16.67
  Bottom 0.254: v33.5,5.4 33.5,14.13 v30.96,16.67
ADC4
  Top 0.254: R16.2 R17.2 33.42,12.72 33.42,15.48 30.96,17.93 IC9.10
ADC5
  Top 0.254: R11.2 R12.2 29.63,16.45 29.96,16.78 IC9.8
ADC/DAC  (via drill 0.51)
  Top 0.254: IC9.21 38.02,29.29 v38.26,29.53
  Top 0.305: R19.1 38.26,30.56 v38.26,29.53 | R32.2 v61.85,23.71 v61.85,23.72
  Bottom 0.254: v38.26,29.53 39.1,29.53 43.23,25.4 60.17,25.4 v61.85,23.72
AUX0  (via drill 0.51)
  Top 0.254: IC6.7 56.17,28.28 55.8,28.65 v55.8,30.48 | IC9.26 43.93,31.79 45.16,33.02 v47.07,33.02 | v61.83,29.69 63.21,29.69 R29.1
  Bottom 0.254: v47.07,33.02 49.61,30.48 v55.8,30.48 61.04,30.48 v61.83,29.69
BOOT0  (via drill 0.51)
  Top 0.254: IC9.60 25.64,29.29 26.04,29.69 v26.04,33.34
  Top 0.305: R20.1 BOOT.1
  Bottom 0.254: BOOT.1 10,42.07 12.14,42.07 13.97,43.89 25.16,43.89 26.67,42.39 26.67,39.78 24.92,38.03 24.92,34.45 v26.04,33.34
BOOT1  (via drill 0.51)
  Top 0.254: IC9.28 32.73,32.79 32.26,33.26 29.05,33.26 v28.1,34.21
  Top 0.305: R21.1 10.95,42.7 BOOT.3
  Bottom 0.254: BOOT.3 12.7,44.45 27.94,44.45 29.21,43.18 29.21,40.18 26.75,37.72 26.75,34.77 27.3,34.21 v28.1,34.21
CLOCK  (via drill 0.51)
  Top 0.254: v40.01,32.62 39.34,33.29 IC9.29 35.05,33.29 33.46,34.88 IC9.34 | RN1.4 59.08,27.41 v58.98,27.3 58.77,27.1 IC6.3
  Top 0.305: 63.26,19.31 R30.2 | 63.22,19.47 R30.2 | v61.95,19.43 63.22,19.43 R30.2
  Bottom 0.254: v40.01,32.62 40.16,32.46 44.21,32.46 49.37,27.3 v58.98,27.3 59.61,27.3 62.55,24.37 62.55,23.42 61.99,22.86 61.52,22.86 61.04,22.38 61.04,20.34 v61.95,19.43
CS  (via drill 0.51)
  Top 0.254: IC9.33 33.96,35.89 v34.53,35.32 | RN1.2 57.38,29.21 v57.39,28.89 57.39,27.7 57.48,27.61 IC6.5 | R31.2 62.14,25.41 61.83,25.72 v61.83,27.23
  Bottom 0.254: v34.53,35.32 35.56,34.29 43.81,34.29 49.21,28.89 v57.39,28.89 60.17,28.89 v61.83,27.23
EE_SCL
  Top 0.254: IC9.58 17.35,30.29 17.07,30 17.07,29.35 IC3.1 17.07,29.33 17.07,28.57 16.89,28.4 R9.1
EE_SDA
  Top 0.254: IC9.59 19,29.79 18.97,29.77 18.98,29.76 IC3.3
  Top 0.406: IC3.3 18.98,28.16 18.95,28.1 R8.1
EE_WP
  Top 0.254: IC9.57 17.55,30.79 17.07,31.27 17.07,31.93 IC3.5
EXVUSB  (via drill 0.51)
  other vias: 10.95,31.75 10.95,30.48 10.95,29.21 10.95,27.94 9.68,27.94 9.68,29.21 9.68,30.48 9.68,31.75 10.79,17.14 8.26,17.14 8.26,15.88 10.79,15.88 10.79,14.61 8.26,14.61
  pour Top (isolate 0.305, no thermals): 7.64,27.68 8.91,27.68 8.91,30.21 7.64,30.21 7.64,32.76 7.62,35.56 11.43,35.56 11.43,25.88 7.64,25.83
  pour Top (no thermals): 7.62,17.78 11.43,17.78 11.43,11.99 7.62,11.99
  pour Bottom: 7.62,33.02 11.43,33.02 11.43,13.97 7.62,13.97
GND  (via drill 0.51)
  Top 0.406: 22.38,47.23 23.42,47.23 23.65,46.99
  other vias: 19.53,23.97 41.75,29.37 71.56,47.92 19.91,47.92 33.5,4.21 55.24,32.54 19.91,1.24 26.83,30 39.83,1.24 45.96,35.96 4.92,21.11 39.83,37.34 43.56,11.82 79.03,40.45 12.38,21.43 35.24,18.26 38.58,24.89 16.51,17.46 22.07,17.14 17.99,28.04 23.97,4.29 59.74,47.92 79.03,24.27 8.09,1.24 4.92,23.42 12.38,23.5 6.81,21.8 79.03,8.09 43.56,37.34 42.32,35.47 32.62,10.16 39.83,47.92 35.16,11.35 21.27,36.91 13.07,14.31 71.56,1.24 1.24,41.07 32.7,17.22 35.08,5.4 1.24,8.09 51.19,3.33 5.87,23.42 59.74,1.24 46.28,28.89 46.2,27.15 36.43,37.39 19.53,17.14 15.8,34.13 27.54,17.22 5.87,21.11 25.16,26.35 12.37,22.49 32.38,13.97 26.67,9.53 26.76,4.36 55.01,18.08 59.78,24
  pour Top (isolate 0.203, rank 2): 0,48.97 80.01,48.97 80.01,0 0,0
  pour Bottom (isolate 0.203, rank 2): 0,48.97 80.01,48.97 arc-3 80.01,0 0,0
IO_ADC/DAC
  Top 0.305: R32.1 68.44,23.71 J3.6
IO_AUX0  (via drill 0.51)
  Top 0.305: R29.2 65.57,29.64 v66.59,28.63
  Bottom 0.305: v66.59,28.63 66.59,28.03 68.9,25.72 70.55,25.72 J3.5
IO_CLK
  Top 0.305: J3.2 65.08,19.42 R30.1
IO_CS
  Top 0.305: J3.4 70.41,23.14 70.41,24.92 69.61,25.72 68.66,25.72 68.35,25.41 R31.1
IO_MISO  (via drill 0.51)
  Top 0.305: R28.2 66.29,27.05 v66.59,26.76
  Bottom 0.305: v66.59,26.76 66.59,25.01 68.34,23.26 70.47,23.26 J3.3
IO_MOSI
  Top 0.305: R27.2 67.36,21.94 68.66,20.64 70.55,20.64 J3.1
IO_OE
  Top 0.254: IC9.38 31.46,37.81 33.02,39.37 46.55,39.37 46.55,39.33 47.92,37.96 57.25,37.96 59.74,35.47 60.08,35.17 IC6.1
LA_AUX0  (via drill 0.51)
  Top 0.254: IC6.14 56.17,21.06 v55.8,21.43 | v31.39,28.43 27.24,28.43 26.96,28.15 IC9.2
  Top 0.305: v38.58,21.16 39.83,21.16 39.83,21.03 39.77,20.97 IC4.5
  Bottom 0.305: v55.8,21.43 55.4,21.03 38.71,21.03 v38.58,21.16 31.39,28.35 v31.39,28.43
LA_CLOCK  (via drill 0.51)
  Top 0.254: IC6.18 58.77,22.9 58.9,23.02 58.9,23.81 v58.5,24.21 | IC9.25 35.07,31.29 34.29,32.07 v33.42,32.07 | IC5.2 v49.69,23.73
  Bottom 0.254: v58.5,24.21 58.26,24.45 49.69,24.45 | v49.69,23.73 49.69,24.45 | 49.69,24.45 42.23,24.45 34.61,32.07 v33.42,32.07
LA_CS  (via drill 0.51)
  Top 0.254: IC6.16 57.48,22.61 v57.16,22.93 | 49.69,20.64 IC5.7 49.69,21.51 v50.48,22.3 | v33.34,30.48 34.61,30.48 34.8,30.29 IC9.23
  Top 0.305: 49.69,20.16 IC5.7
  Bottom 0.254: v57.16,22.93 57.07,23.02 55.4,23.02 54.69,22.3 v50.48,22.3 48.5,22.3 48.1,22.7 42.55,22.7 34.77,30.48 v33.34,30.48
LA_MISO  (via drill 0.51)
  Top 0.254: IC6.15 56.83,21.84 v56.67,21.99 | v47.78,21.91 47.15,21.27 IC5.5 | IC9.22 34.31,29.79 v34.29,29.77
  Bottom 0.254: v56.67,21.99 56.52,22.15 55.4,22.15 54.85,21.59 48.1,21.59 v47.78,21.91 42.62,21.91 38.1,26.43 37.98,26.55 34.77,29.77 v34.29,29.77
LA_MOSI  (via drill 0.51)
  Top 0.254: IC6.17 v58.12,23.31 | v48.42,23.5 IC5.3 | IC9.24 34.93,30.79 34.53,31.19 v34.05,31.19
  Bottom 0.254: v58.12,23.31 57.71,23.73 55.24,23.73 54.93,23.42 50.48,23.42 50.01,22.94 49.05,22.94 48.5,23.5 v48.42,23.5 42.47,23.5 34.77,31.19 v34.05,31.19
LD1
  Top 0.254: IC9.39 30.96,39.05 31.74,39.83 31.74,42.32 33.87,44.45 40.4,44.45 41.95,46 R5.2
MISO  (via drill 0.51)
  Top 0.254: IC9.35 32.96,37.56 v33.5,38.1 | RN1.1 56.52,32.02 v56.52,29.61 56.52,28.73 56.83,28.42 IC6.6 | v61.83,28.34 61.96,28.34 R28.1
  Bottom 0.254: v33.5,38.1 40.96,38.1 49.45,29.61 v56.52,29.61 60.56,29.61 v61.83,28.34
MOSI  (via drill 0.51)
  Top 0.254: IC9.30 40.27,33.79 v40.56,33.5 | IC9.36 v32.46,35.25 v32.46,35.24 | RN1.3 58.19,28.41 v58.18,28.1 58.12,28.2 IC6.4
  Top 0.305: R27.1 61.87,21.94 v61.83,21.91
  Bottom 0.254: v32.46,35.24 33.92,33.79 40.27,33.79 v40.56,33.5 43.89,33.5 49.29,28.1 v58.18,28.1 59.53,28.1 63.02,24.61 63.02,23.1 v61.83,21.91
MS0  (via drill 0.51)
  Top 0.254: IC9.61 23.2,28.79 v22.94,29.05
  Top 0.305: SW1.2 17.46,3.1 v20.32,3.1 22.54,3.1 SW1.1
  Bottom 0.254: v22.94,29.05 22.62,29.37 20.48,29.37 20.32,29.21 v20.32,3.1
N$1
  Top 0.254: RN1.5 59.08,34.98 58.66,35.4 55.8,35.4 55.4,35 50.4,35 50.2,35.21 IC2.2
N$2
  Top 0.254: RN1.7 57.38,33.26 57.15,33.02 55.88,33.02 55.56,33.34 50.48,33.34 48.9,31.75 IC2.11
N$3
  Top 0.61: Q1.3 D1.A
N$4
  Top 0.254: RN1.8 50.19,33.99 47.59,31.4 IC2.9
N$5
  Top 0.254: IC2.3 49.55,34.83 49.85,34.53 55.64,34.53 56.04,34.92 58.02,34.92 58.18,34.77 RN1.6
N$6  (via drill 0.51)
  Top 0.305: R5.1 v45.75,46 LED2A.A
  Bottom 0.305: v45.75,46 LED2A.A
N$7  (via drill 0.51)
  Top 0.305: R3.1 v18.25,46 LED1A.A
  Bottom 0.305: LED1A.A v18.25,46
N$8  (via drill 0.51)
  Top 0.305: Q2.1 39.47,7.3 | 39.47,7.3 R14.2 | 39.47,7.3 v37.31,7.3 | v37.31,11.43 R2.1
  Bottom 0.305: v37.31,7.3 v37.31,11.43
N$13  (via drill 0.51)
  Top 0.305: LED4A.A v34.25,46 R4.1
  Bottom 0.305: LED4A.A v34.25,46
N$14
  Top 0.61: Q2.3 D2.A
N$15
  Top 0.61: D3.A JP1.1
N$16
  Top 0.254: IC9.5 28.46,23.94 27.94,23.42 23.42,23.42 22.86,22.86 XTAL1.2 22.86,19.34 C2.2
N$17
  Top 0.305: Q1.1 39.47,11.11 R13.2 R1.2
N$18  (via drill 0.51)
  Top 0.305: R6.1 v61.75,46 LED3A.A
  Bottom 0.305: LED3A.A v61.75,46
N$20
  Top 0.254: IC9.6 28.96,22.61 XTAL1.1 27.94,21.03 26.11,19.21 26.11,18.79 C1.2
PULLUPEN  (via drill 0.51)
  Top 0.254: v48.1,34.05 47.59,34.56 IC2.6 47.59,37.1 45.88,38.81 33.1,38.81 31.96,37.67 IC9.37
  Top 0.305: IC2.12 IC2.13 50.2,31.04 | IC2.5 IC2.6 | 50.2,31.04 50.2,31.72 v50.16,31.75 | R7.2 50.22,31.01 50.2,31.04
  Bottom 0.254: v50.16,31.75 50.16,31.99 v48.1,34.05
PUVSEL33  (via drill 0.51)
  Top 0.254: 27.46,26.83 v27.7,27.15 27.46,26.82 IC9.3
  Top 0.305: R2.2 v34.87,14.82
  Bottom 0.254: v27.7,27.15 28.02,27.15 29.45,25.72 29.45,21.33 33.6,17.42 34.15,16.88 34.15,15.54 v34.87,14.82
PUVSEL50  (via drill 0.51)
  Top 0.254: v34.85,16.18 38.58,16.18 39.37,15.39 R1.1 | IC9.4 27.96,26.29 28.89,27.23 v28.89,27.62
  Bottom 0.254: v34.85,16.18 34.85,16.8 29.87,21.78 29.87,25.93 28.89,26.91 v28.89,27.62
RST  (via drill 0.51)
  Top 0.254: IC9.7 29.46,26.76 v29.77,27.07 | 57.46,3.1 59.74,3.1 | 62.54,3.1 59.74,3.1 | v59.74,4.05 59.74,3.1 | R33.1 C15.2 54.37,2.95 54.46,2.86 56.61,2.86 SW2.2
  Top 0.305: SW2.1 62.54,3.1 | SW2.2 57.46,3.1
  Bottom 0.254: v29.77,27.07 30.56,26.27 30.56,21.71 38.58,13.69 38.58,5.6 40.13,4.05 v59.74,4.05
SRAM_CLK  (via drill 0.51)
  Top 0.254: IC5.6 v48.42,18.41 | v41.66,18.41 41.66,18.43 41.04,19.05 IC4.6 v41.04,21.83 | v30.96,33.97 30.8,33.97 29.46,35.31 IC9.42
  Bottom 0.254: v48.42,18.41 v41.66,18.41
  Bottom 0.305: v30.96,33.97 30.96,30.03 39.16,21.83 v41.04,21.83
SRAM_CS  (via drill 0.51)
  Top 0.254: IC5.1 50.96,27.38 50.24,28.1 44.29,28.1 43.58,27.38 | 43.58,27.38 IC4.1 | 43.58,27.38 42.7,27.38 v42.55,27.54 | IC9.41 29.96,35.76 30.88,34.85 31.75,34.85 v32.99,33.6 32.78,33.81
  Bottom 0.254: v42.55,27.54 36.91,33.18 33.42,33.18 v32.99,33.6
SWCLK  (via drill 0.51)
  Top 0.254: IC9.49 25.9,34.79 v25.96,34.85
  Bottom 0.254: v25.96,34.85 27.3,33.5 28.65,33.5 29.84,34.69 29.84,37.47 J1.4
SWDIO  (via drill 0.51)
  Top 0.254: IC9.46 27.46,35.56 27.7,35.32 28.42,35.32 v28.5,35.24
  Bottom 0.254: v28.5,35.24 28.97,35.72 28.97,39.13 J1.3
SWV33  (via drill 0.51)
  Top 0.305: Q2.2 v40.64,5.4 | J3.8 67.21,29.06 67.21,34.23 58.9,42.53 R6.2
  Top 0.61: C18.1 29.63,3.39 29.92,3.1 38.02,3.1 39.37,4.45 R14.1 39.47,5.4 Q2.2 | v73.7,8.93 73.7,24.77 72.67,25.8 70.48,25.8 69.24,27.04 J3.8
  Bottom 0.61: v40.64,5.4 70.17,5.4 v73.7,8.93
  pour Top (no thermals): 30.48,7.54 30.48,4.76 27.7,4.76 27.7,7.54
SWV50  (via drill 0.51)
  Top 0.254: Q1.2 v40.64,9.21
  Top 0.61: C16.1 29.63,8.87 30,8.49 33.02,8.49 33.84,9.31 R13.1 39.47,9.21 Q1.2
  Bottom 0.61: v40.64,9.21 71.44,9.21 73.69,11.46 73.69,27.94 72.05,29.58 J3.9
  pour Top (no thermals): 30.48,13.34 30.48,9.6 27.7,9.6 27.7,13.34
UART_CK  (via drill 0.58)
  Top 0.254: IC9.20 33.84,28.79 v33.58,29.05 | v36.72,25.51 36.72,23.21 37.39,22.54 37.39,19.99 38.72,18.65 39.93,18.65 43.02,15.56 55.01,15.56 55.88,16.43 60.11,16.43 60.36,16.18 60.36,13.72 UART.2
  Bottom 0.305: v33.58,29.05 33.58,28.65 v36.72,25.51
UART_CTS
  Top 0.254: IC9.14 32.96,24.43 35.48,21.91 35.48,19.28 37.96,16.8 39.2,16.8 42.32,13.69 55.31,13.69 UART.6
UART_RTS
  Top 0.254: IC9.15 33.46,24.56 35.96,22.07 35.96,19.43 38.17,17.22 39.45,17.22 42.55,14.13 55.56,14.13 56.28,13.41 58.12,13.41 UART.4
UART_RX
  Top 0.254: IC9.17 35.84,23.46 36.91,22.38 36.91,19.75 38.48,18.18 39.77,18.18 42.86,15.08 55.24,15.08 56.12,15.95 58.12,15.95 UART.3
UART_TX
  Top 0.254: IC9.16 33.96,24.7 36.43,22.23 36.43,19.59 38.33,17.7 39.61,17.7 42.7,14.61 56.22,14.61 UART.5
USB_D+
  Top 0.254: USB.D+ 12.62,24.5 14.45,26.33 14.45,38.03 14.84,38.43 17.22,38.43 | IC9.45 27.96,38.25 27.78,38.43 17.22,38.43 | R24.1 17.15,38.36 17.22,38.43
USB_D-
  Top 0.254: USB.D- 12.7,25.3 13.97,26.57 13.97,38.43 14.53,38.99 28.18,38.99 28.46,38.7 IC9.44
USB_DET
  Top 0.254: R24.2 20.3,36.13 22.65,33.79 IC9.51
USBLED
  Top 0.254: IC9.40 30.46,38.44 29.29,39.61 29.29,41.67 29.77,42.15 30.72,42.15 33.5,44.93 36.67,44.93 37.1,45.35 R4.2
VBUS  (via drill 0.51)
  Top 0.254: IC9.52 20.35,33.29 v19.84,32.78 | v15.48,20.8 16.86,20.8 R26.2
  Top 0.305: R26.2 16.9,20.77 R25.1
  Bottom 0.254: v19.84,32.78 17.22,32.78 15.8,31.35 15.8,21.11 v15.48,20.8
VEXTERN  (via drill 0.51)
  Top 0.254: IC2.1 50.84,36.71 50.72,36.83 48.97,36.83 48.9,36.75 IC2.4 48.9,33.73 46.95,31.78 46.95,31.11 | IC2.10 48.24,29.43 48.1,29.29 46.99,29.29 46.95,29.33 IC2.8 46.95,31.11 | C10.1 46.92,30.93 46.95,31.11
  Top 0.305: D1.C 50.16,12.48 R23.1 | J3.7 71.54,27.04 70.56,28.02 70.56,33.36 v67.21,36.72 | v51.65,36.72 50.85,36.72 50.84,36.71
  Top 0.61: D1.C v50.16,7.62 D2.C | v74.95,27 J3.7
  Bottom 0.305: v67.21,36.72 v51.65,36.72
  Bottom 0.61: v50.16,7.62 71.12,7.62 74.95,11.46 v74.95,27
VREGEN  (via drill 0.51)
  Top 0.254: VR2.3 25.4,3.42 25.4,3.41 v25.4,2.54 | 25.4,8.57 VR3.3 25.4,8.54 v25.4,7.62 | IC9.62 21.88,28.29 v21.59,28.57
  Bottom 0.254: v25.4,2.54 v25.4,7.62 21.19,11.83 21.19,28.18 v21.59,28.57
VUSB  (via drill 0.51)
  Top 0.305: IC2.14 50.84,29.01 52.01,27.84 C3.1 R7.1 52.85,29.25 54.14,29.25 v54.14,31.74 | R11.1 v24.13,15.24 | R25.2 18.05,18.15 18.05,15.56
  Bottom 0.305: v24.13,15.24 24.13,10.81 32.4,2.54 68.58,2.54 68.58,2.62 75.92,9.96 75.92,29.87 74.05,31.74 v54.14,31.74
  pour Top (no thermals): 9.37,10.16 17.78,10.16 17.78,15.95 25.4,15.95 25.4,5.08 23.5,5.08 23.5,7.62 9.37,7.62

### Text on the board
tPlace: NOV 2017 | GND +5V | Ian Lesnet | I+S 2017 | v.trocio
bPlace: MAR 2014
tNames: B0 | B1 | PWR | USB | MODE | VREG | Bus Pirate V5.0 | 3.3V | GND | SW- / DIO | SW- / CLK | +5V | VPU | AUX | MISO | MOSI | TX | RX | GND | CTS | RTS | CLK | GND | 3V3 | ADC/DAC | CS | CLK
bNames: PWR | USB | MODE | VREG | GND | +5V | +3.3 | VPU | Bus Pirate V5.0 | ADC/ / DAC | AUX | CS | MISO | CLK | MOSI | Fulfillment by | Seeed Studio | www.seeedstudio.com
tValues: vimark
Reference: EXT PWR | USB-OTG | GND - 5V | I/O header | GND | +5v | USB | +3v3 | Vpu | ADC/DAC | AUX0 | CS | MISO | CLK | MOSI | BUS PIRATE V5.0 | CC-0 | Ian Lesnet NOV 2017 | http://dangerousprototypes.com